# EasyEDA Pro project ProPrj_Iris One_2026-02-20.epro

# Schematic Iris One
Board Name: IrisV1.0; Create Date: 2026-02-19; Page Name: P1; Project Name: Iris One; Schematic Name: Iris One; Update Date: 2026-02-20; Company: root://workspace; Drawn: NullByte; Page Size: A4; Version: V1.0
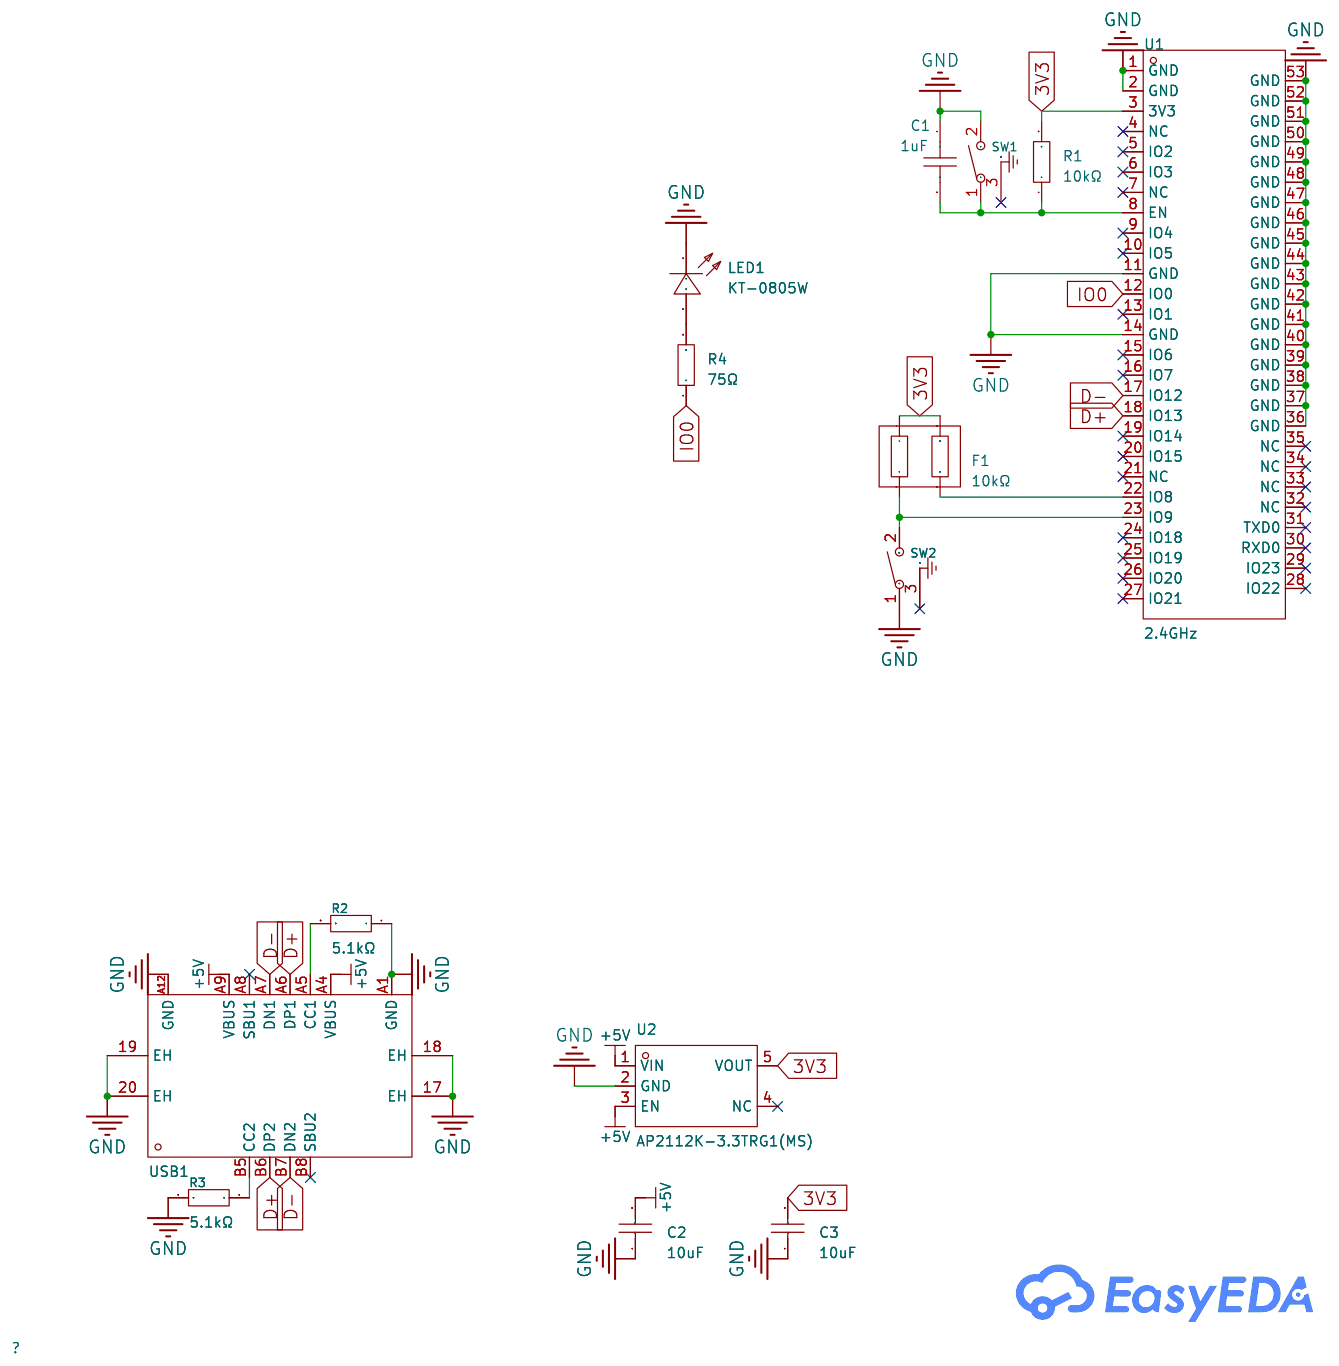
[diagram p0: schematic sheet]

## Parts
C1  1uF  [C0402]
C2  10uF  [C0402]
C3  10uF  [C0402]
F1  10kΩ  [RES-ARRAY-SMD_0404-4P-L1.0-W1.0-BL]
LED1  KT-0805W  [LED0805-R-RD]
R1  10kΩ  [R0402]
R2  5.1kΩ  [R0402]
R3  5.1kΩ  [R0402]
R4  75Ω  [R0402]
SW1  SKTDLHE010  [KEY-SMD_SKTDLHE010]
SW2  SKTDLHE010  [KEY-SMD_SKTDLHE010]
U1  2.4GHz  [WIFIM-SMD_61P-L16.6-W13.2-P0.80-ESP32-C6-MINI-1-N4]
U2  AP2112K-3.3TRG1(MS)  [SOT-23-5_L2.9-W1.6-P0.95-LS2.7-BR]
USB1  TYPE-C 16P QTGM027  [USB-C-SMD_TYPE-C-16P-QTGM027]

## Library data of the parts
C1 = CL05A105KA5NQNC: Capacitance:1uF Tolerance:±10% Tolerance:±10% Voltage Rating:25V Temperature Coefficient:X5R; LCSC Part Name: 1uF ±10% 25V; Supplier Part: C52923; Manufacturer: SAMSUNG(三星); Supplier Footprint: 0402; JLCPCB Part Class: Basic Part; Datasheet: https://item.szlcsc.com/datasheet/CL05A105KA5NQNC/53938.html; Supplier: LCSC; Tolerance: ±10%; Voltage Rating: 25V; Temperature Coefficient: X5R
C2 C3 = CL05A106MQ5NUNC: Capacitance:10uF Tolerance:±20% Tolerance:±20% Voltage Rating:6.3V Temperature Coefficient:X5R; LCSC Part Name: 10uF ±20% 6.3V; Supplier Part: C15525; Manufacturer: SAMSUNG(三星); Supplier Footprint: 0402; JLCPCB Part Class: Basic Part; Datasheet: https://item.szlcsc.com/datasheet/CL05A106MQ5NUNC/16204.html; Supplier: LCSC; Tolerance: ±20%; Voltage Rating: 6.3V; Temperature Coefficient: X5R
F1 = YC122-JR-0710KL: Number of Resistors: Resistance: Tolerance:±5% Tolerance:±5% Power(Watts): Temperature Coefficient:±200ppm/℃ Temperature Coefficient:±200ppm/℃ Number of Pins:; LCSC Part Name: 10kΩ ±5%; Supplier Part: C695179; Manufacturer: YAGEO(国巨); Supplier Footprint: 0402x2; JLCPCB Part Class: Extended Part; Datasheet: https://atta.szlcsc.com/upload/public/pdf/source/20200630/C695179_C01B8AD03C65079234DFC6C85CDBB06F.pdf; Supplier: LCSC; Tolerance: ±5%; Temperature Coefficient: ±200ppm/℃
LED1 = KT-0805W: LCSC Part Name: 0805 白灯 高亮; Supplier Part: C34499; Manufacturer: KENTO; Supplier Footprint: 0805; JLCPCB Part Class: Basic Part; Datasheet: https://atta.szlcsc.com/upload/public/pdf/source/20221124/DAA20402FFC1FB071B8B6797757426FE.pdf; Supplier: LCSC
R1 = 0402WGF1002TCE: Type:Thick Film Resistor Resistance:10kΩ Tolerance:±1% Tolerance:±1% Power(Watts):62.5mW Voltage-Supply(Max):50V Temperature Coefficient:±100ppm/℃ Temperature Coefficient:±100ppm/℃ Operating Temperature:-55℃~+155℃ Operating Temperature:-55℃~+155℃; LCSC Part Name: 10kΩ ±1% 62.5mW 厚膜电阻; Supplier Part: C25744; Manufacturer: UNI-ROYAL(厚声); Supplier Footprint: 0402; JLCPCB Part Class: Basic Part; Datasheet: https://item.szlcsc.com/datasheet/0402WGF1002TCE/26487.html; Supplier: LCSC; Type: Thick Film Resistor; Tolerance: ±1%; Power(Watts): 62.5mW; Voltage-Supply(Max): 50V; Temperature Coefficient: ±100ppm/℃; Operating Temperature: -55℃~+155℃
R2 R3 = 0402WGF5101TCE: Type:Thick Film Resistor Resistance:5.1kΩ Tolerance:±1% Tolerance:±1% Power(Watts):62.5mW Voltage-Supply(Max):50V Temperature Coefficient:±100ppm/℃ Temperature Coefficient:±100ppm/℃ Operating Temperature:-55℃~+155℃ Operating Temperature:-55℃~+155℃; LCSC Part Name: 5.1kΩ ±1% 62.5mW 厚膜电阻; Supplier Part: C25905; Manufacturer: UNI-ROYAL(厚声); Supplier Footprint: 0402; JLCPCB Part Class: Basic Part; Datasheet: https://item.szlcsc.com/datasheet/0402WGF5101TCE/26648.html; Supplier: LCSC; Type: Thick Film Resistor; Tolerance: ±1%; Power(Watts): 62.5mW; Voltage-Supply(Max): 50V; Temperature Coefficient: ±100ppm/℃; Operating Temperature: -55℃~+155℃
R4 = 0402WGF750JTCE: Type:Thick Film Resistor Resistance:75Ω Tolerance:±1% Tolerance:±1% Power(Watts):62.5mW Voltage-Supply(Max):50V Temperature Coefficient:±100ppm/℃ Temperature Coefficient:±100ppm/℃ Operating Temperature:-55℃~+155℃ Operating Temperature:-55℃~+155℃; LCSC Part Name: 75Ω ±1% 62.5mW 厚膜电阻; Supplier Part: C25133; Manufacturer: UNI-ROYAL(厚声); Supplier Footprint: 0402; JLCPCB Part Class: Extended Part; Datasheet: https://item.szlcsc.com/datasheet/0402WGF750JTCE/25876.html; Supplier: LCSC; Type: Thick Film Resistor; Tolerance: ±1%; Power(Watts): 62.5mW; Voltage-Supply(Max): 50V; Temperature Coefficient: ±100ppm/℃; Operating Temperature: -55℃~+155℃
SW1 SW2 = SKTDLHE010: Circuit:SPST Actuator Style:Rectangle button Mounting Style:卧贴 With Lamp:- Mechanical Life:-; Supplier Part: C380198; Manufacturer: ALPSALPINE(阿尔卑斯阿尔派); Supplier Footprint: SMD; JLCPCB Part Class: Extended Part; Datasheet: https://atta.szlcsc.com/upload/public/pdf/source/20200409/C380198_178C729B1AFCBF15D3CDD9052567B65D.pdf; Supplier: LCSC; Circuit: SPST; Actuator Style: Rectangle button; Mounting Style: 卧贴
U1 = ESP32-C6-MINI-1-N4: Utilized IC / Part:ESP32-C6FH4 Interface Type:I2C；GPIO；UART；SPI；I2S Frequency:2.4GHz Antenna Type:On-board PCB Antenna Output Power:20.5dBm Output Power:20.5dBm Voltage - Supply:3V~3.6V Voltage - Supply:3V~3.6V Receive  Current:78mA Send  Current:382mA Se; Supplier Part: C5736265; Manufacturer: ESPRESSIF(乐鑫); Supplier Footprint: SMD-53P; JLCPCB Part Class: Extended Part; Datasheet: https://item.szlcsc.com/datasheet/ESP32-C6-MINI-1-N4/6661848.html; Supplier: LCSC; Utilized IC / Part: ESP32-C6FH4; Interface Type: I2C；GPIO；UART；SPI；I2S; Antenna Type: On-board PCB Antenna; Output Power: 20.5dBm; Voltage - Supply: 3V~3.6V; Receive  Current: 78mA; Send  Current: 382mA; Sensitivity: -99.2dBm; Operating Temperature: -40℃~+85℃
U2 = AP2112K-3.3TRG1(MS): Output Type:Fixed Voltage - Supply:6V Output Voltage:3.3V Output Voltage:3.3V Output Current:600mA Power Supply Rejection Ratio (PSRR):75dB@(1kHz) Voltage Dropout:- standby current:2uA Noise:- Features:Automatic Discharge Function；Low ESR；Overheat protect; Supplier Part: C22365427; Manufacturer: MSKSEMI(美森科); Supplier Footprint: SOT-23-5; JLCPCB Part Class: Extended Part; Datasheet: https://item.szlcsc.com/datasheet/AP2112K-3.3TRG1(MS)/23832169.html; Supplier: LCSC; Output Type: Fixed; Voltage - Supply: 6V; Output Voltage: 3.3V; Output Current: 600mA; Power Supply Rejection Ratio (PSRR): 75dB@(1kHz); standby current: 2uA; Features: Automatic Discharge Function；Low ESR；Overheat protection；Overcurrent Protection；With ability; Operating Temperature: -40℃~+125℃@(Tj); Output Configuration: Positive electrode; Number of Outputs: 1
USB1 = TYPE-C 16P QTGM027: Connector Type:Type-C Protocol Standard:USB 3.1 Gender:Female Mounting Type:Surface Mount, Right Angle Number of Contacts:16P Number of Ports:1 Current Rating-Power:3A Voltage Rating:20V Connect-Disconnect Life:5,000 times Detection color:Black Operating; LCSC Part Name: 16P卧贴母座; Supplier Part: C2681552; Manufacturer: SHOU HAN(首韩); Supplier Footprint: SMD; JLCPCB Part Class: Extended Part; Datasheet: https://item.szlcsc.com/datasheet/TYPE-C%252016P%2520QTGM027/2774895.html; Supplier: LCSC; Connector Type: Type-C; Protocol Standard: USB 3.1; Gender: Female; Mounting Type: Surface Mount, Right Angle; Number of Contacts: 16P; Number of Ports: 1; Current Rating-Power: 3A; Voltage Rating: 20V; Connect-Disconnect Life: 5,000 times; Detection color: Black; Operating Temperature: -30℃~+80℃

## Nets
3V3: C3.2 F1.3 F1.4 R1.2 U1.3(3V3) U2.5(VOUT)
+5V: C2.2 U2.1(VIN) U2.3(EN) USB1.A4(VBUS) USB1.A9(VBUS)
GND: C1.1 C2.1 C3.1 LED1.2(K) R2.1 R3.2 SW1.2 SW2.1 U1.1(GND) U1.2(GND) U1.11(GND) U1.14(GND) U1.36(GND) U1.37(GND) U1.38(GND) U1.39(GND) U1.40(GND) U1.41(GND) U1.42(GND) U1.43(GND) U1.44(GND) U1.45(GND) U1.46(GND) U1.47(GND) U1.48(GND) U1.49(GND) U1.50(GND) U1.51(GND) U1.52(GND) U1.53(GND) U2.2(GND) USB1.17(EH) USB1.18(EH) USB1.19(EH) USB1.20(EH) USB1.A1(GND) USB1.A12(GND)
D+: U1.18(IO13) USB1.A6(DP1) USB1.B6(DP2)
D-: U1.17(IO12) USB1.A7(DN1) USB1.B7(DN2)
IO0: R4.1 U1.12(IO0)
$1N9305: F1.2 U1.22(IO8)
$1N9321: F1.1 SW2.2 U1.23(IO9)
$1N9412: C1.2 R1.1 SW1.1 U1.8(EN)
$1N11906: R3.1 USB1.B5(CC2)
$1N11910: R2.2 USB1.A5(CC1)
$1N12514: LED1.1(A) R4.2

Not connected (* = marked no-connect by the designer): SW1 3(GND)*; SW2 3(GND)*; U1 4(NC)* 5(IO2)* 6(IO3)* 7(NC)* 9(IO4)* 10(IO5)* 13(IO1)* 15(IO6)* 16(IO7)* 19(IO14)* 20(IO15)* 21(NC)* 24(IO18)* 25(IO19)* 26(IO20)* 27(IO21)* 28(IO22)* 29(IO23)* 30(RXD0)* 31(TXD0)* 32(NC)* 33(NC)* 34(NC)* 35(NC)*; U2 4(NC)*; USB1 A8(SBU1)* B8(SBU2)*

# Board PCB3
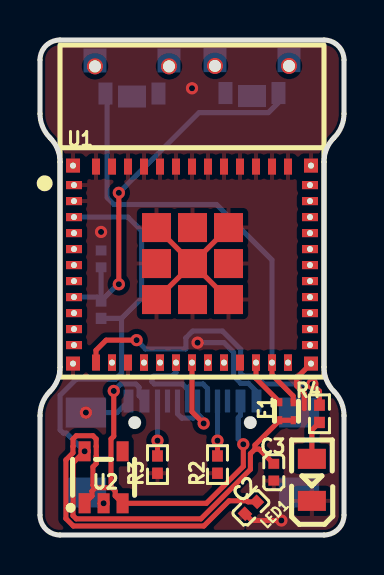
[diagram p1: board, top side]
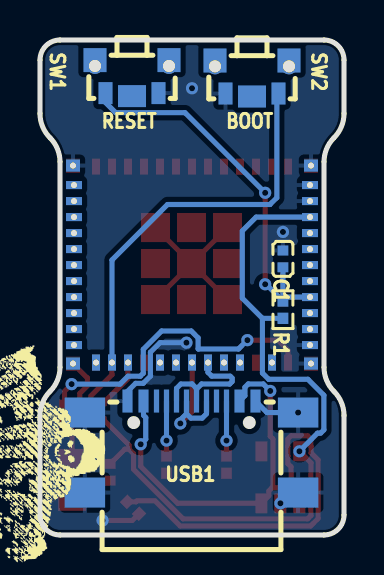
[diagram p2: board, bottom side, seen from below]

Outline 15.2 x 24.75 mm; copper layers: Top Layer, Bottom Layer. Coordinates in mm from the lower left corner of the outline.
Outline path: 0,23.75 arc(0.29,24.46) 1,24.75 14.2,24.75 arc(14.91,24.46) 15.2,23.75 15.2,21.07 arc(15.07,20.42) 14.7,19.86 arc(14.33,19.31) 14.2,18.66 14.2,8.39 arc(14.33,7.73) 14.7,7.18 arc(15.07,6.63) 15.2,5.97 15.2,1 arc(14.91,0.29) 14.2,0 1,0 arc(0.29,0.29) 0,1 0,5.97 arc(0.13,6.63) 0.5,7.18 arc(0.87,7.73) 1,8.39 1,18.66 arc(0.87,19.31) 0.5,19.86 arc(0.13,20.42) 0,21.07 0,23.75
Stack: Top Layer 0.035mm / Dielectric1 1.51mm FR4 er 4.5 / Bottom Layer 0.035mm

## Design rules (mm)
template: JLCPCB Capability(Two Layers Board)
spacing copperThickness1oz (default): track to track 0.102, other pairs 0.152 to 0.3
spacing copperThickness2oz: track to track 0.203, other pairs 0.152 to 0.3
track width copperThickness1oz (default): min 0.127, default 0.254, max 2.54
track width copperThickness2oz: min 0.203, default 0.254, max 2.54
differential pair differentialPair (default): width min 0.127, default 0.254, max 2.54; gap min 0.152, default 0.152
via viaSize (default): diameter min 0.5, default 0.61, max 10; hole min 0.3, default 0.305, max 6.3

## Placement (name value [footprint] x y rotation side)
C1  1uF  [C0402]  3.05 13.81 270 bottom
C2  10uF  [C0402]  10.55 1.36 45 top
C3  10uF  [C0402]  11.69 3.14 90 top
F1  10kΩ  [RES-ARRAY-SMD_0404-4P-L1.0-W1.0-BL]  12.32 6.19 180 top
LED1  KT-0805W  [LED0805-R-RD]  13.59 2.76 90 top
NOREF  -  [Pad_e68]  1.7 10.3 0 top
NOREF#2  -  [Pad_e76]  1.7 16.7 0 top
NOREF#3  -  [Pad_e107]  8.4 8.62 90 top
NOREF#4  -  [Pad_e111]  5.2 8.62 90 top
NOREF#5  -  [Pad_e129]  1.65 18.47 0 top
NOREF#6  -  [Pad_e109]  6.8 8.62 90 top
NOREF#7  -  [Pad_e106]  9.2 8.62 90 top
NOREF#8  -  [Pad_e114]  3.6 8.62 90 top
NOREF#9  -  [Pad_e101]  13.5 9.5 0 top
NOREF#10  -  [Pad_e110]  6 8.62 90 top
NOREF#11  -  [Pad_e93]  13.5 15.9 0 top
NOREF#12  -  [Pad_e130]  1.65 8.57 0 top
NOREF#13  -  [Pad_e91]  13.5 17.5 180 top
NOREF#14  -  [Pad_e71]  1.7 12.7 0 top
NOREF#15  -  [Pad_e128]  13.55 18.47 0 top
NOREF#16  -  [Pad_e96]  13.5 13.5 0 top
NOREF#17  -  [Pad_e75]  1.7 15.9 0 top
NOREF#18  -  [Pad_e103]  11.6 8.62 90 top
NOREF#19  -  [Pad_e131]  13.55 8.57 0 top
NOREF#20  -  [Pad_e73]  1.7 14.3 0 top
NOREF#21  -  [Pad_e102]  12.4 8.62 90 top
NOREF#22  -  [Pad_e70]  1.7 11.9 0 top
NOREF#23  -  [Pad_e95]  13.5 14.3 0 top
NOREF#24  -  [Pad_e72]  1.7 13.5 0 top
NOREF#25  -  [Pad_e94]  13.5 15.1 0 top
NOREF#26  -  [Pad_e100]  13.5 10.3 0 top
NOREF#27  -  [Pad_e77]  1.7 17.5 0 top
NOREF#28  -  [Pad_e67]  1.7 9.5 0 top
NOREF#29  -  [Pad_e97]  13.5 12.7 0 top
NOREF#30  -  [Pad_e108]  7.6 8.62 90 top
NOREF#31  -  [Pad_e104]  10.8 8.62 90 top
NOREF#32  -  [Pad_e99]  13.5 11.1 0 top
NOREF#33  -  [Pad_e74]  1.7 15.1 0 top
NOREF#34  -  [Pad_e92]  13.5 16.7 0 top
NOREF#35  -  [Pad_e69]  1.7 11.1 0 top
NOREF#36  -  [Pad_e98]  13.5 11.9 0 top
R1  10kΩ  [R0402]  3.05 11.27 270 bottom
R2  5.1kΩ  [R0402]  8.88 3.52 90 top
R3  5.1kΩ  [R0402]  5.88 3.52 270 top
R4  75Ω  [R0402]  13.97 6.06 270 top
SW1  SKTDLHE010  [KEY-SMD_SKTDLHE010]  10.6 22.84 180 bottom
SW2  SKTDLHE010  [KEY-SMD_SKTDLHE010]  4.6 22.82 180 bottom
U1  2.4GHz  [WIFIM-SMD_61P-L16.6-W13.2-P0.80-ESP32-C6-MINI-1-N4]  7.6 13.52 0 top
U2  AP2112K-3.3TRG1(MS)  [SOT-23-5_L2.9-W1.6-P0.95-LS2.7-BR]  3.18 2.89 270 top
USB1  TYPE-C 16P QTGM027  [USB-C-SMD_TYPE-C-16P-QTGM027]  7.62 4.41 180 bottom

## Footprints (pads in the part's own frame, mm; a bottom-side part is the same pattern mirrored in y, then rotated)
C0402
  rect 0.5x0.54 smd: 1(-0.42,0) 2(0.42,0)
KEY-SMD_SKTDLHE010
  rect 0.7x1.1 smd: 1(-1.325,-0.75) 2(1.325,-0.75)
  round 0.8 hole 0.6: 3(-1.85,0.608) 3(1.85,0.608)
  rect 1.15x1.2 smd: 3(-1.85,0.9) 3(1.85,0.9)
  rect 1.4x1.1 smd: 3(0,-0.9)
LED0805-R-RD
  rect 1x1.399 smd: 1(1.05,0) 2(-1.05,0)
Pad_e67
  rect 0.8x0.4 hole 0.3: 1(0,0)
Pad_e68
  rect 0.8x0.4 hole 0.3: 1(0,0)
Pad_e69
  rect 0.8x0.4 hole 0.3: 1(0,0)
Pad_e70
  rect 0.8x0.4 hole 0.3: 1(0,0)
Pad_e71
  rect 0.8x0.4 hole 0.3: 1(0,0)
Pad_e72
  rect 0.8x0.4 hole 0.3: 1(0,0)
Pad_e73
  rect 0.8x0.4 hole 0.3: 1(0,0)
Pad_e74
  rect 0.8x0.4 hole 0.3: 1(0,0)
Pad_e75
  rect 0.8x0.4 hole 0.3: 1(0,0)
Pad_e76
  rect 0.8x0.4 hole 0.3: 1(0,0)
Pad_e77
  rect 0.8x0.4 hole 0.3: 1(0,0)
Pad_e91
  rect 0.8x0.4 hole 0.3: 1(0,0)
Pad_e92
  rect 0.8x0.4 hole 0.3: 1(0,0)
Pad_e93
  rect 0.8x0.4 hole 0.3: 1(0,0)
Pad_e94
  rect 0.8x0.4 hole 0.3: 1(0,0)
Pad_e95
  rect 0.8x0.4 hole 0.3: 1(0,0)
Pad_e96
  rect 0.8x0.4 hole 0.3: 1(0,0)
Pad_e97
  rect 0.8x0.4 hole 0.3: 1(0,0)
Pad_e98
  rect 0.8x0.4 hole 0.3: 1(0,0)
Pad_e99
  rect 0.8x0.4 hole 0.3: 1(0,0)
Pad_e100
  rect 0.8x0.4 hole 0.3: 1(0,0)
Pad_e101
  rect 0.8x0.4 hole 0.3: 1(0,0)
Pad_e102
  rect 0.8x0.4 hole 0.3: 1(0,0)
Pad_e103
  rect 0.8x0.4 hole 0.3: 1(0,0)
Pad_e104
  rect 0.8x0.4 hole 0.3: 1(0,0)
Pad_e106
  rect 0.8x0.4 hole 0.3: 1(0,0)
Pad_e107
  rect 0.8x0.4 hole 0.3: 1(0,0)
Pad_e108
  rect 0.8x0.4 hole 0.3: 1(0,0)
Pad_e109
  rect 0.8x0.4 hole 0.3: 1(0,0)
Pad_e110
  rect 0.8x0.4 hole 0.3: 1(0,0)
Pad_e111
  rect 0.8x0.4 hole 0.3: 1(0,0)
Pad_e114
  rect 0.8x0.4 hole 0.3: 1(0,0)
Pad_e128
  rect 0.7x0.6 hole 0.3: 1(0,0)
Pad_e129
  rect 0.7x0.6 hole 0.3: 1(0,0)
Pad_e130
  rect 0.7x0.6 hole 0.3: 1(0,0)
Pad_e131
  rect 0.7x0.6 hole 0.3: 1(0,0)
R0402
  rect 0.566x0.54 smd: 1(-0.433,0) 2(0.433,0)
RES-ARRAY-SMD_0404-4P-L1.0-W1.0-BL
  rect 0.25x0.4 smd: 1(-0.335,-0.45) 2(0.335,-0.45) 3(0.335,0.45) 4(-0.335,0.45)
SOT-23-5_L2.9-W1.6-P0.95-LS2.7-BR
  rect 1x0.6 smd: 1(1.3,-0.95) 2(1.3,0) 3(1.3,0.95) 4(-1.3,0.95) 5(-1.3,-0.95)
USB-C-SMD_TYPE-C-16P-QTGM027
  rect 2.02x1.5 smd: 17(5.33,1.712) 18(5.33,-2.288) 19(-5.33,-2.288) 20(-5.33,1.712)
  rect 0.5x1.15 smd: A1(-3.2,2.288) A4(-2.4,2.288) A9(2.4,2.288) A12(3.2,2.288)
  rect 0.26x1.15 smd: A5(-1.25,2.288) A6(-0.25,2.288) A7(0.25,2.288) A8(1.25,2.288) B5(1.75,2.288) B6(0.75,2.288) B7(-0.75,2.288) B8(-1.75,2.288)
WIFIM-SMD_61P-L16.6-W13.2-P0.80-ESP32-C6-MINI-1-N4
  rect 0.8x0.4 smd: 1(-5.9,3.975) 2(-5.9,3.175) 3(-5.9,2.375) 4(-5.9,1.575) 5(-5.9,0.775) 6(-5.9,-0.025) 7(-5.9,-0.825) 8(-5.9,-1.625) 9(-5.9,-2.425) 10(-5.9,-3.225) 11(-5.9,-4.025) 25(5.9,-4.025) 26(5.9,-3.225) 27(5.9,-2.425) 28(5.9,-1.625) 29(5.9,-0.825) 30(5.9,-0.025) 31(5.9,0.775) 32(5.9,1.575) 33(5.9,2.375) 34(5.9,3.175) 35(5.9,3.975)
  rect 0.4x0.8 smd: 12(-4.8,-4.9) 13(-4,-4.9) 14(-3.2,-4.9) 15(-2.4,-4.9) 16(-1.6,-4.9) 17(-0.8,-4.9) 18(0,-4.9) 19(0.8,-4.9) 20(1.6,-4.9) 21(2.4,-4.9) 22(3.2,-4.9) 23(4,-4.9) 24(4.8,-4.9) 36(4.8,4.9) 37(4,4.9) 38(3.2,4.9) 39(2.4,4.9) 40(1.6,4.9) 41(0.8,4.9) 42(0,4.9) 43(-0.8,4.9) 44(-1.6,4.9) 45(-2.4,4.9) 46(-3.2,4.9) 47(-4,4.9) 48(-4.8,4.9)
  rect 1.45x1.45 smd: 49(-1.775,1.85) 49(-1.775,0.05) 49(-1.775,-1.75) 49(0.025,1.85) 49(0.025,0.05) 49(0.025,-1.75) 49(1.825,1.85) 49(1.825,0.05) 49(1.825,-1.75)
  rect 0.7x0.7 smd: 50(5.95,4.95) 51(5.95,-4.95) 52(-5.95,-4.95) 53(-5.95,4.95)

## Nets
3V3: C3.2 F1.3 F1.4 NOREF#17.1 R1.2 U1.3 U2.5
+5V: C2.2 U2.1 U2.3 USB1.A4 USB1.A9
GND: C1.1 C2.1 C3.1 LED1.2 NOREF#2.1 NOREF#5.1 NOREF#12.1 NOREF#15.1 NOREF#19.1 NOREF#27.1 NOREF#28.1 R2.1 R3.2 SW1.2 SW2.1 U1.1 U1.2 U1.11 U1.14 U1.36 U1.37 U1.38 U1.39 U1.40 U1.41 U1.42 U1.43 U1.44 U1.45 U1.46 U1.47 U1.48 U1.49 U1.50 U1.51 U1.52 U1.53 U2.2 USB1.17 USB1.18 USB1.19 USB1.20 USB1.A1 USB1.A12
D+: NOREF#30.1 U1.18 USB1.A6 USB1.B6
D-: NOREF#6.1 U1.17 USB1.A7 USB1.B7
IO0: R4.1 U1.12
$1N9305: F1.2 NOREF#31.1 U1.22
$1N9321: F1.1 NOREF#18.1 SW2.2 U1.23
$1N9412: C1.2 NOREF#22.1 R1.1 SW1.1 U1.8
$1N11906: R3.1 USB1.B5
$1N11910: R2.2 USB1.A5
$1N12514: LED1.1 R4.2

Pads without a net: NOREF 1; NOREF#3 1; NOREF#4 1; NOREF#7 1; NOREF#8 1; NOREF#9 1; NOREF#10 1; NOREF#11 1; NOREF#13 1; NOREF#14 1; NOREF#16 1; NOREF#20 1; NOREF#21 1; NOREF#23 1; NOREF#24 1; NOREF#25 1; NOREF#26 1; NOREF#29 1; NOREF#32 1; NOREF#33 1; NOREF#34 1; NOREF#35 1; NOREF#36 1; SW1 3; SW2 3; U1 4 5 6 7 9 10 13 15 16 19 20 21 24 25 26 27 28 29 30 31 32 33 34 35; U2 4; USB1 A8 B8

## Via types
v1: diameter 0.61, hole 0.305, Top Layer to Bottom Layer, 16 vias

## Routing (per net, layer and track width the routed paths; a pad name or vN(x,y) marks a point on that pad's centre or on a via; arc(x,y) is an arc through that point)
3V3: length 37.5
  Top Layer w0.254: 10.75,4.29 10.75,4.5 11.99,5.74 F1.4 ; 10.75,4.29 10.95,4.29 C3.2 ; 10.75,4.29 10.52,4.07 10.52,3.28 8.04,0.81 1.81,0.81 1.65,0.97 1.65,3.61 v1(2.23,4.19)
  Bottom Layer w0.254: v1(2.23,4.19) 1.32,5.09 1.17,5.09 1.01,5.26 1.01,6.99 1.81,7.79 3.77,7.79 4.08,8.1 4.08,10.83 ; 4.08,10.83 R1.2 ; 4.08,10.83 5.09,11.84 5.09,15.2 4.39,15.9 NOREF#17.1
+5V: length 38.5
  Top Layer w0.254: 2.76,2.36 2.6,2.2 2.6,1.96 U2.1 ; 2.76,2.36 3.6,2.36 ; 2.76,2.36 2.65,2.48 2.65,3.41 2.81,3.57 2.81,3.94 2.81,3.94 2.81,4.43 2.81,4.43 2.81,4.8 2.65,4.96 1.81,4.96 1.65,4.8 1.65,4.43 1.65,4.43 1.65,4.1 1.29,3.75 1.29,0.82 1.67,0.45 8.19,0.45 9.45,1.71 10.35,1.71 10.4,1.66 C2.2 ; 3.6,2.36 3.55,2.41 3.55,4.8 3.69,4.94 v1(3.69,7.2) ; 3.6,2.36 3.76,2.2 3.76,1.96 U2.3 8.32,1.58 10.16,3.43 v1(10.16,4.54)
  Bottom Layer w0.254: v1(10.16,4.54) 9.91,4.79 9.91,5.87 10.03,5.99 USB1.A4 ; v1(3.69,7.2) 4.04,7.55 4.79,7.55 4.95,7.39 4.95,6.97 USB1.A9
GND: length 22.4
  Top Layer w0.254: U1.49 U1.49 ; U1.49 U1.49 ; U1.49 U1.49 ; U1.49 U1.49 ; v1(12.07,0.73) 10.59,0.73 C2.1 ; NOREF#19.1 12.83,7.85 12.83,7.46 13.21,7.08 13.21,6.31
  Bottom Layer w0.254: USB1.A12 3.85,6.12 v1(2.29,6.12) ; v1(7.88,9.62) 9.2,9.62 9.68,9.14 9.68,7.94 10.04,7.58 10.42,7.58 10.82,7.18 USB1.A1
  vias: v1(3.05,15.15) v1(3.18,1.58) v1(7.6,22.34)
D+: length 6.3
  Top Layer w0.254: v1(8.18,5.58) 7.6,6.16 U1.18
  Bottom Layer w0.254: 7.88,6.06 USB1.A6 ; 7.88,6.06 8.18,5.75 v1(8.18,5.58) ; 7.88,6.06 7.66,5.84 7.09,5.84 6.88,6.06 USB1.B6
D-: length 6.4
  Bottom Layer w0.254: USB1.A7 7.38,7.3 ; 7.38,7.3 7.12,7.55 5.71,7.55 5.59,7.67 5.59,7.84 5.69,7.94 6.61,7.94 6.8,8.13 NOREF#6.1 ; 7.38,7.3 7.38,7.33 7.6,7.55 8.16,7.55 8.38,7.33 USB1.B7
IO0: length 15.5
  Top Layer w0.254: R4.1 13.97,7.19 v1(13.62,7.54) ; U1.12 2.8,9.24 3.31,9.74 v1(4.83,9.74)
  Bottom Layer w0.254: v1(13.62,7.54) 11.2,7.54 10.8,7.94 10.19,7.94 10.04,8.09 10.04,9.28 9.12,10.2 7.64,10.2 7.29,9.86 7.29,9.31 7.28,9.3 5.27,9.3 v1(4.83,9.74)
$1N9305: length 2.5
  Top Layer w0.254: U1.22 10.8,7.83 11.99,6.64
$1N9321: length 22.3
  Top Layer w0.254: NOREF#18.1 11.6,8.01 12.66,6.95 F1.1
  Bottom Layer w0.254: NOREF#18.1 11.6,13.75 8.82,16.53 3.7,16.53 3.36,16.87 3.36,21.99 SW2.2
$1N9412: length 19.3
  Top Layer w0.254: v1(3.94,12.54) v1(3.94,17.11)
  Bottom Layer w0.254: R1.1 3.89,12.54 v1(3.94,12.54) ; R1.1 2.86,11.9 U1.8 ; R1.1 C1.2 ; v1(3.94,17.11) 7.95,21.12 11.42,21.12 11.93,21.63 11.93,22.09
$1N11906: length 2.7
  Top Layer w0.254: R3.1 v1(5.88,4.72)
  Bottom Layer w0.254: v1(5.88,4.72) USB1.B5
$1N11910: length 2.7
  Top Layer w0.254: R2.2 v1(8.88,4.72)
  Bottom Layer w0.254: v1(8.88,4.72) USB1.A5
$1N12514: length 2
  Top Layer w0.254: R4.2 13.59,5.25 LED1.1

## Copper pours and planes (outline as drawn; the poured copper is in the pictures)
GND on Top Layer: -4.69,30.06 20.45,30.06 20.45,-0.92 -4.69,-0.92
GND on Bottom Layer: -6.98,31.84 23.25,31.84 23.25,-2.45 -6.98,-2.45

## Text on the board
Bottom Silkscreen Layer: BOOT | RESET
